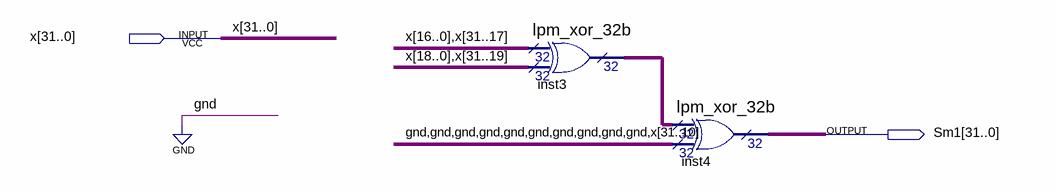
[diagram p0: schematic sheet]
// Quartus schematic Sm1.bdf as structural Verilog: 2 symbols, 2 pins
module Sm1 (
  input  [31:0] x,
  output [31:0] Sm1
);

  wire [31:0] inst3_result;

  lpm_xor_32b inst3 (.data0x({x[16:0], x[31:17]}), .data1x({x[18:0], x[31:19]}), .result(inst3_result));
  lpm_xor_32b inst4 (.data0x(inst3_result), .data1x({{10{1'b0}}, x[31:10]}), .result(Sm1));
endmodule
